# Altium schematic sheet Screen.SchDoc
size A3; Author: ALP Electronics; CompanyName: ALP Electronics; DrawnBy: Caner Alp; Engineer: Caner Alp; Organization: ALP Electronics; Address2: Västerås; Address4: Sweden; SheetNumber: 8; SheetTotal: 13
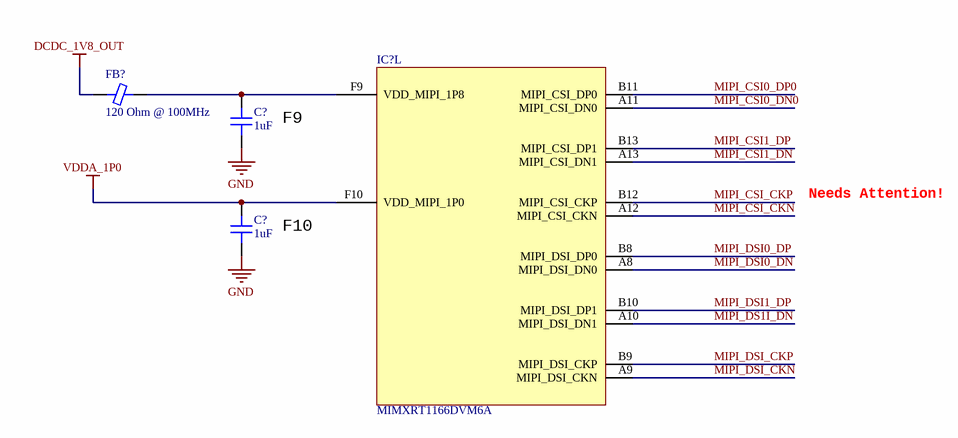
[diagram p0: Screen.SchDoc]

## Parts
(Parts that share a designator on the sheet are numbered #1, #2 ... from top to bottom, then left to right.)
C?#1  1uF  [CAP 0402/1005]
C?#2  1uF  [CAP 0402/1005]
FB?  120 Ohm @ 100MHz  [FER 0402/1005]
IC?  MIMXRT1166DVM6A  [BGA289C80P17X17_1400X1400X152]  (part L of 12)

## Nets
DCDC_1V8_OUT: FB?.1
GND: C?#1.1 C?#2.1
VDDA_1P0: C?#2.2 IC?.F10(VDD_MIPI_1P0)
MIPI_CSI0_DN0: IC?.A11(MIPI_CSI_DN0)
MIPI_CSI0_DP0: IC?.B11(MIPI_CSI_DP0)
MIPI_CSI1_DN: IC?.A13(MIPI_CSI_DN1)
MIPI_CSI1_DP: IC?.B13(MIPI_CSI_DP1)
MIPI_CSI_CKN: IC?.A12(MIPI_CSI_CKN)
MIPI_CSI_CKP: IC?.B12(MIPI_CSI_CKP)
MIPI_DS1I_DN: IC?.A10(MIPI_DSI_DN1)
MIPI_DSI0_DN: IC?.A8(MIPI_DSI_DN0)
MIPI_DSI0_DP: IC?.B8(MIPI_DSI_DP0)
MIPI_DSI1_DP: IC?.B10(MIPI_DSI_DP1)
MIPI_DSI_CKN: IC?.A9(MIPI_DSI_CKN)
MIPI_DSI_CKP: IC?.B9(MIPI_DSI_CKP)
NetC?#1_2: C?#1.2 FB?.2 IC?.F9(VDD_MIPI_1P8)

## Notes on the sheet
- (near C?#1) F9
- Needs Attention!
- (near C?#2) F10
- Title:
- Size:
- Project:
- A3
- Date:
- Revision:
- Drawn By:
- Sheet
- of

## Library data of the parts
C?#1 C?#2 = GRM155R60J105KE19D: CAP CER 1UF 6.3V X5R 0402; Manufacturer: Murata Electronics North America; TemperatureRange: -55C ~ 85C; Tolerance: 10%; Value: 1uF; Part Number: GRM155R60J105KE19D; PartId: 12330; Supplier 1: Digi-Key; Supplier Part Number 1: 490-1320-2-ND; ComponentLink1Description: Datasheet; ComponentLink1URL: http://www.murata.com/~/media/webrenewal/support/library/catalog/products/capacitor/mlcc/c02e.pdf; ComponentLink2Description: Digi-Key Listing; ComponentLink2URL: https://www.digikey.com/product-detail/en/murata-electronics-north-america/GRM155R60J105KE19D/490-1320-2-ND/587208; TemperatureCoefficient: X5R; Voltage: 6.3V; Price: 0,006; Device Package: 0402 (1005 Metric)
FB? = CIM05U121NC: FERRITE CHIP 120 OHM 600MA 0402; Manufacturer: Samsung Electro-Mechanics America, Inc.; Type: Differential Mode - Single; DC Resistance: 250 mOhm Max; Part Number: CIM05U121NC; PartId: 6447; Value: 120 Ohm @ 100MHz; Supplier 1: Digi-Key; Supplier Part Number 1: 1276-6345-2-ND; ComponentLink1Description: Datasheet; ComponentLink1URL: http://www.samsungsem.com/kr/front/downloadcms.do?path=/kr/support/product-search/bead/__icsFiles/afieldfile/2014/11/13&fileName=S_CIM05J102NC.pdf; ComponentLink2Description: Digi-Key listing; ComponentLink2URL: http://digikey.com/product-detail/en/CIM05U121NC/1276-6345-2-ND/3973775; Price: 0,0147; Device Package: 0402 (1005 Metric); Current Rating: 600mA
IC? = MIMXRT1166DVM6A: Integrated Circuit; Manufacturer_Name: NXP; Datasheet Link: https://www.mouser.in/datasheet/2/302/IMXRT1160CEC-2335852.pdf; Height: 1.52mm; Manufacturer_Part_Number: MIMXRT1166DVM6A; Mouser Part Number: 771-MIMXRT1166DVM6A; Mouser Price/Stock: https://www.mouser.co.uk/ProductDetail/NXP-Semiconductors/MIMXRT1166DVM6A?qs=DRkmTr78QARbPfoaiaD1vg%3D%3D